# Altium schematic sheet çizim 2.SchDoc
size A3
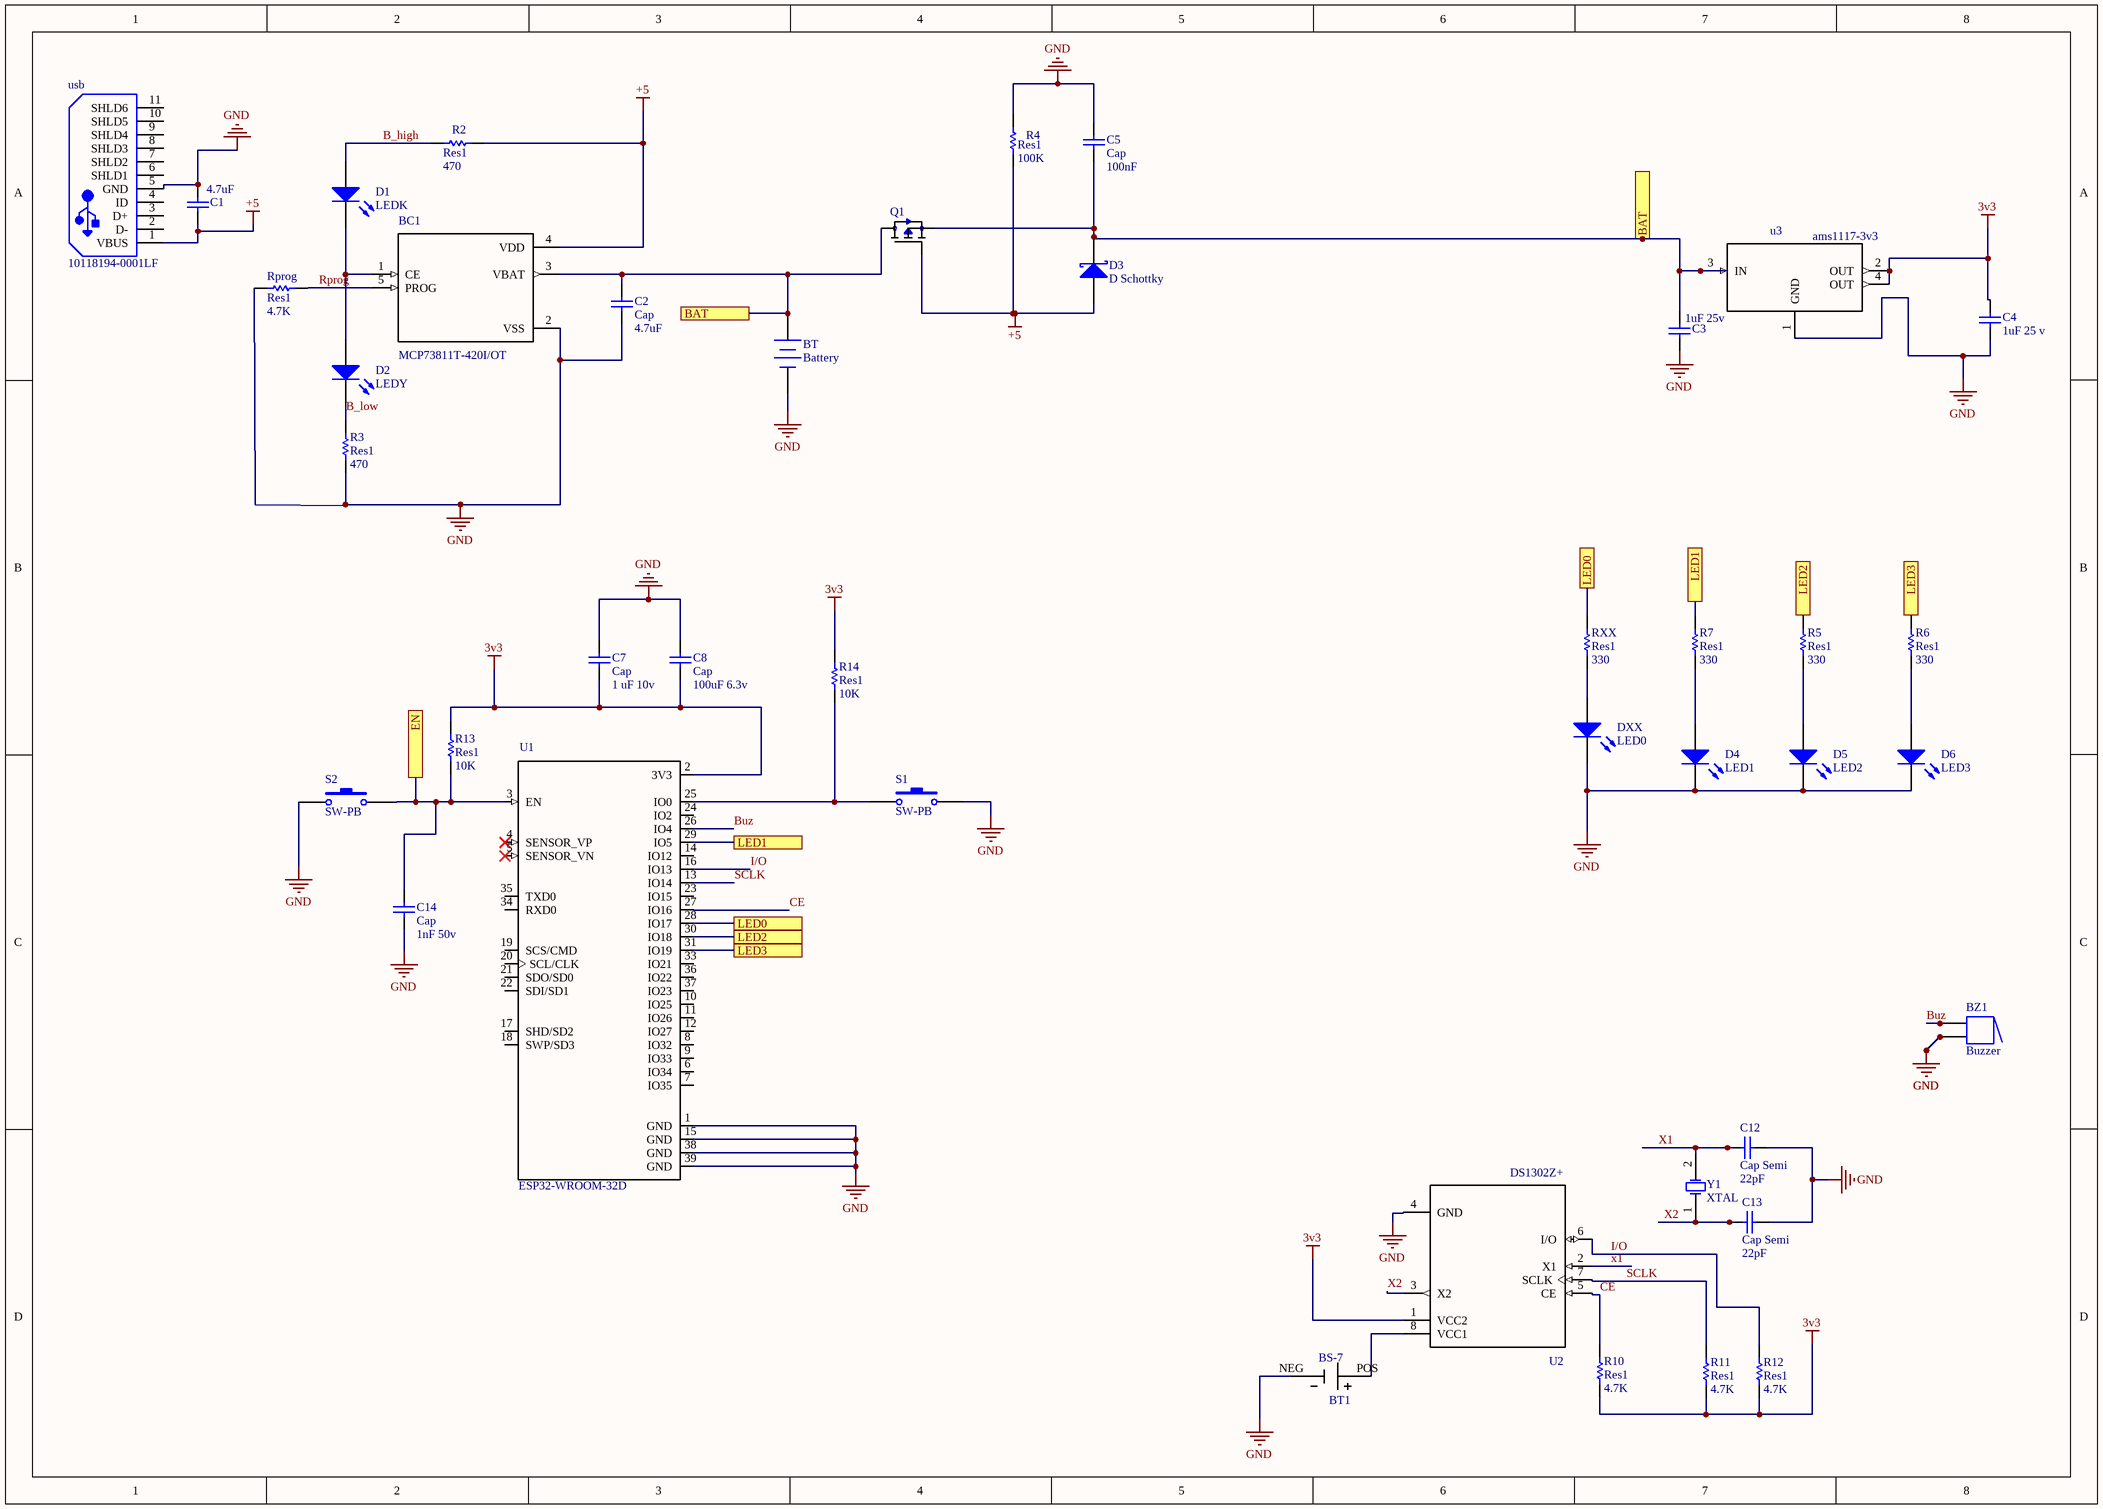
[diagram p0: çizim 2.SchDoc]

## Parts
BC1  MCP73811T-420I/OT  [*SOT95P280X145-5N]
BT  Battery  [BAT-2]
BT1  BS-7  [*BAT_BS-7_BS-7(Primary)]
BZ1  Buzzer
C1  value 4.7uF  [14-1210]  (hidden comment: Cap)
C2  Cap  value 4.7uF  [14-1210]
C3  value 1uF 25v  [6-0805_L]  (hidden comment: Cap)
C4  value 1uF 25 v  [6-0805_L]  (hidden comment: Cap)
C5  Cap  value 100nF  [6-0805_N]
C7  Cap  value 1 uF 10v  [6-0805_N]
C8  Cap  value 100uF 6.3v  [6-0805_N]
C12  Cap Semi  value 22pF  [0402]
C13  Cap Semi  value 22pF  [0402]
C14  Cap  value 1nF 50v  [6-0805_N]
D1  LEDK  [6-0805_N]
D2  LEDY  [6-0805_N]
D3  D Schottky  [DO-41]
D4  LED1  [6-0805_N]
D5  LED2  [6-0805_N]
D6  LED3  [6-0805_N]
DXX  LED0  [6-0805_N]
Q1  IRLML6402TRPBF  [*SOT95P237X112-3N]  (value not drawn)
R2  Res1  value 470  [6-0805_N]
R3  Res1  value 470  [6-0805_N]
R4  Res1  value 100K  [6-0805_N]
R5  Res1  value 330  [6-0805_N]
R6  Res1  value 330  [6-0805_N]
R7  Res1  value 330  [6-0805_N]
R10  Res1  value 4.7K  [6-0805_N]
R11  Res1  value 4.7K  [6-0805_N]
R12  Res1  value 4.7K  [6-0805_N]
R13  Res1  value 10K  [6-0805_L]
R14  Res1  value 10K  [6-0805_L]
Rprog  Res1  value 4.7K  [AXIAL-0.3]
RXX  Res1  value 330  [6-0805_N]
S1  SW-PB  [TE FSMSMTR]
S2  SW-PB  [TE FSMSMTR]
U1  ESP32-WROOM-32D  [*MODULE_ESP32-WROOM-32D]
U2  DS1302Z+  [DIP794W47P254L991H457Q8]
u3  ams1117-3v3  [*SOT223]
usb  10118194-0001LF  [usb b micro]
Y1  XTAL  [R38]

## Ports
BAT, EN, LED0, LED1, LED2, LED3

## Nets
3v3: C4.1 C7.1 C8.1 R10.1 R11.1 R12.1 R13.2 R14.2 U1.2(3V3) U2.1(VCC2) u3.2(OUT) u3.4(OUT)
+5: BC1.4(VDD) C1.1 D3.1(A) Q1.1(G) R2.1 R4.1 usb.1(VBUS)
GND: BC1.2(VSS) BT.2(-) BT1.NEG BZ1.2 BZ1.2A C1.2 C2.1 C3.1 C4.2 C5.2 C7.2 C8.2 C12.1 C13.1 C14.1 D4.2(K) D5.2(K) D6.2(K) DXX.2(K) R3.1 R4.2 Rprog.2 S1.2 S2.1 U1.1(GND) U1.15(GND) U1.38(GND) U1.39(GND) U2.4(GND) u3.1(GND) usb.5(GND)
B_high: D1.1(A) R2.2
B_low: D2.2(K) R3.2
BAT: BC1.3(VBAT) BT.1(+) C2.2 C3.2 C5.1 D3.2(K) Q1.2(S) Q1.3(D) u3.3(IN) ; port BAT
Buz: BZ1.1 BZ1.1A U1.26(IO4)
CE: R10.2 U1.27(IO16) U2.5(CE)
EN: C14.2 R13.1 S2.2 U1.3(EN) ; port EN
I/O: R12.2 U1.16(IO13) U2.6(I/O)
LED0: RXX.2 U1.28(IO17) ; port LED0
LED1: R7.2 U1.29(IO5) ; port LED1
LED2: R5.2 U1.30(IO18) ; port LED2
LED3: R6.2 U1.31(IO19) ; port LED3
Rprog: BC1.5(PROG) Rprog.1
SCLK: R11.2 U1.13(IO14) U2.7(SCLK)
x1: C12.2 U2.2(X1) Y1.2(OSC2)
X2: C13.2 U2.3(X2) Y1.1(OSC1)
NetBC1_1: BC1.1(CE) D1.2(K) D2.1(A)
NetBT1_POS: BT1.POS U2.8(VCC1)
NetD4_1: D4.1(A) R7.1
NetD5_1: D5.1(A) R5.1
NetD6_1: D6.1(A) R6.1
NetDXX_1: DXX.1(A) RXX.1
NetR14_1: R14.1 S1.1 U1.25(IO0)

Not connected (* = marked no-connect by the designer): U1 4(SENSOR_VP)* 5(SENSOR_VN)* 6(IO34) 7(IO35) 8(IO32) 9(IO33) 10(IO25) 11(IO26) 12(IO27) 14(IO12) 17(SHD/SD2) 18(SWP/SD3) 19(SCS/CMD) 20(SCL/CLK) 21(SDO/SD0) 22(SDI/SD1) 23(IO15) 24(IO2) 33(IO21) 34(RXD0) 35(TXD0) 36(IO22) 37(IO23); usb 2(D-) 3(D+) 4(ID) 6(SHLD1) 7(SHLD2) 8(SHLD3) 9(SHLD4) 10(SHLD5) 11(SHLD6)

## Library data of the parts
BC1 = MCP73811T-420I/OT: Charger IC Lithium Ion/Polymer SOT-23-5; MF: Microchip; Availability: Unavailable; Package: SOT-23 Microchip; MP: MCP73811T-420I/OT; SnapEDA_Link: https://www.snapeda.com/parts/MCP73811T-420I/OT/Microchip/view-part/53210/?ref=snap; Price: None; Value: *
BT = Battery: Multicell Battery; Published: 24-Mar-1999; LatestRevisionDate: 17-Jul-2002; LatestRevisionNote: Re-released for DXP Platform.; PackageReference: BAT-2; Publisher: Altium Limited; PackageDescription: Battery; 2 Leads
BT1 = BS-7: BATTERY HOLDER COIN 20MM PC PIN; MF: MPD _Memory; Price: None; Package: None; SnapEDA_Link: https://www.snapeda.com/parts/BS-7/MPD%20%28Memory%20Protection%20Devices%29/view-part/4219629/?ref=snap; Availability: Unavailable; MP: BS-7; Value: *
BZ1 = Buzzer: Magnetic Transducer Buzzer; Published: 24-Mar-1999; LatestRevisionDate: 17-Dec-2003; LatestRevisionNote: Schematic revised, PCB Footprint replaced.; DatasheetVersion: 17-Dec-2003; PackageReference: ABSM-1574; Publisher: Altium Limited; PackageDescription: Magnetic Transducer Buzzer; ComponentLink1Description: Manufacturer Link; ComponentLink1URL: http://www.megastar.com/linecard/buzzmode/index.php
C1-C5 C7 C8 C14 = Cap: Capacitor; Published: 8-Jun-2000; LatestRevisionDate: 17-Jul-2002; LatestRevisionNote: Re-released for DXP Platform.; PackageReference: RAD-0.3; Publisher: Altium Limited; PackageDescription: Radial Cap, Thru-Hole; 2 Leads; 0.3 in Pin Spacing
C12 C13 = Cap Semi: Capacitor (Semiconductor SIM Model); Published: 8-Jun-2000; LatestRevisionDate: 29-May-2009; LatestRevisionNote: IPC-7351 Footprint Added.; PackageReference: C1206; Publisher: Altium Limited; PackageDescription: Chip Capacitor
D1 D2 D4-D6 DXX = LED0: Typical INFRARED GaAs LED; Published: 8-Jun-2000; LatestRevisionDate: 08-Jul-2005; LatestRevisionNote: Mech Layer 1 removed.; PackageReference: LED-0; Publisher: Altium Limited; PackageDescription: LED; 2 Leads
D3 = D Schottky: Schottky Diode; Published: 8-Jun-2000; LatestRevisionDate: 17-Jul-2002; LatestRevisionNote: Re-released for DXP Platform.; PackageReference: SMB; Publisher: Altium Limited; PackageDescription: DO-214-AA/SMB; 2 C-Bend Leads; Body 5.3 x 3.6 mm, inc. leads (LxW); Code_JEDEC: DO-214-AA
R2-R7 R10-R14 Rprog RXX = Res1: Resistor; Published: 8-Jun-2000; LatestRevisionDate: 17-Jul-2002; LatestRevisionNote: Re-released for DXP Platform.; PackageReference: AXIAL-0.3; Publisher: Altium Limited; PackageDescription: Axial Device, Thru-Hole; 2 Leads; 0.3 in Pin Spacing
S1 S2 = SW-PB: Switch; Published: 24-Mar-1999; LatestRevisionDate: 17-Jul-2002; LatestRevisionNote: Re-released for DXP Platform.; PackageReference: SPST-2; Publisher: Altium Limited; PackageDescription: Switch; 2 Leads
U1 = ESP32-WROOM-32D: Bluetooth, WiFi 802.11b/g/n, Bluetooth v4.2 + EDR, Class 1, 2 and 3 Transceiver Module 2.4GHz ~ 2.5GHz Integrated, Trace Surface Mount; MF: Espressif Systems; Availability: Unavailable; Price: None; SnapEDA_Link: https://www.snapeda.com/parts/ESP32-WROOM-32D/Espressif%20Systems/view-part/2768115/?ref=snap; MP: ESP32-WROOM-32D; Package: Module Espressif Systems; Value: *
U2 = DS1302Z+: Real Time Clock _RTC_ IC Clock/Calendar 31B 3-Wire Serial 8-SOIC _0.154, 3.90mm Width_; MF: Maxim Integrated; Price: None; SnapEDA_Link: https://www.snapeda.com/parts/DS1302Z/Maxim%20Integrated/view-part/2748183/?ref=snap; Availability: Unavailable; Package: SOIC-8 Maxim Integrated; MP: DS1302Z; Value: *
u3 = LD1117S33CTR: Linear Voltage Regulator IC 1 Output 800mA SOT-223; MF: STMicroelectronics; Package: SOT-223 STMicroelectronics; MP: LD1117S33CTR; Price: None; Availability: Unavailable; SnapEDA_Link: https://www.snapeda.com/parts/LD1117S33CTR/STMicroelectronics/view-part/46021/?ref=snap; Value: *
usb = usb b micro: Micro USB B Type Receptacle, 1.8 A, -55 to 85 degC, 5-Pin SMD, RoHS, Tape and Reel; Manufacturer: Amphenol FCI; Body Orientation: RightAngle; Number of Contacts: 5; Pitch: 0.65mm; Gender: RCP; Rad Hard: No; Package Reference: 10118194-0001LF-5; Mounting: SurfaceMount; Manufacturer URL: http://www.fci.com/; Packaging: CutTape; Datasheet URL: https://datasheet.ciiva.com/26945/getdatasheetpartid-418619-26945695.pdf; Termination Method: Solder; Package Description: 5-Pin Surface Mount Device, Body 8.05 x 5.53 mm, Pitch 0.65 mm; Type: MicroUSBTypeB; Datasheet Version: Rev. A, 10/2011
Y1 = XTAL: Crystal Oscillator; Published: 8-Jun-2000; LatestRevisionDate: 17-Jul-2002; LatestRevisionNote: Re-released for DXP Platform.; PackageReference: R38; Publisher: Altium Limited; PackageDescription: Crystal, Thru-Hole; 2 Leads; Body 3.1 x 8.2 mm (Dia.xH)
Q1 = IRLML6402TRPBF: SnapEDA_Link: https://www.snapeda.com/parts/IRLML6402TRPBF/Infineon%20Technologies/view-part/523558/?ref=snap; Value: *